# Altium schematic sheet Connector_Sheet.SchDoc
size 420 x 297 mm; SheetNumber: 13; SheetTotal: 14
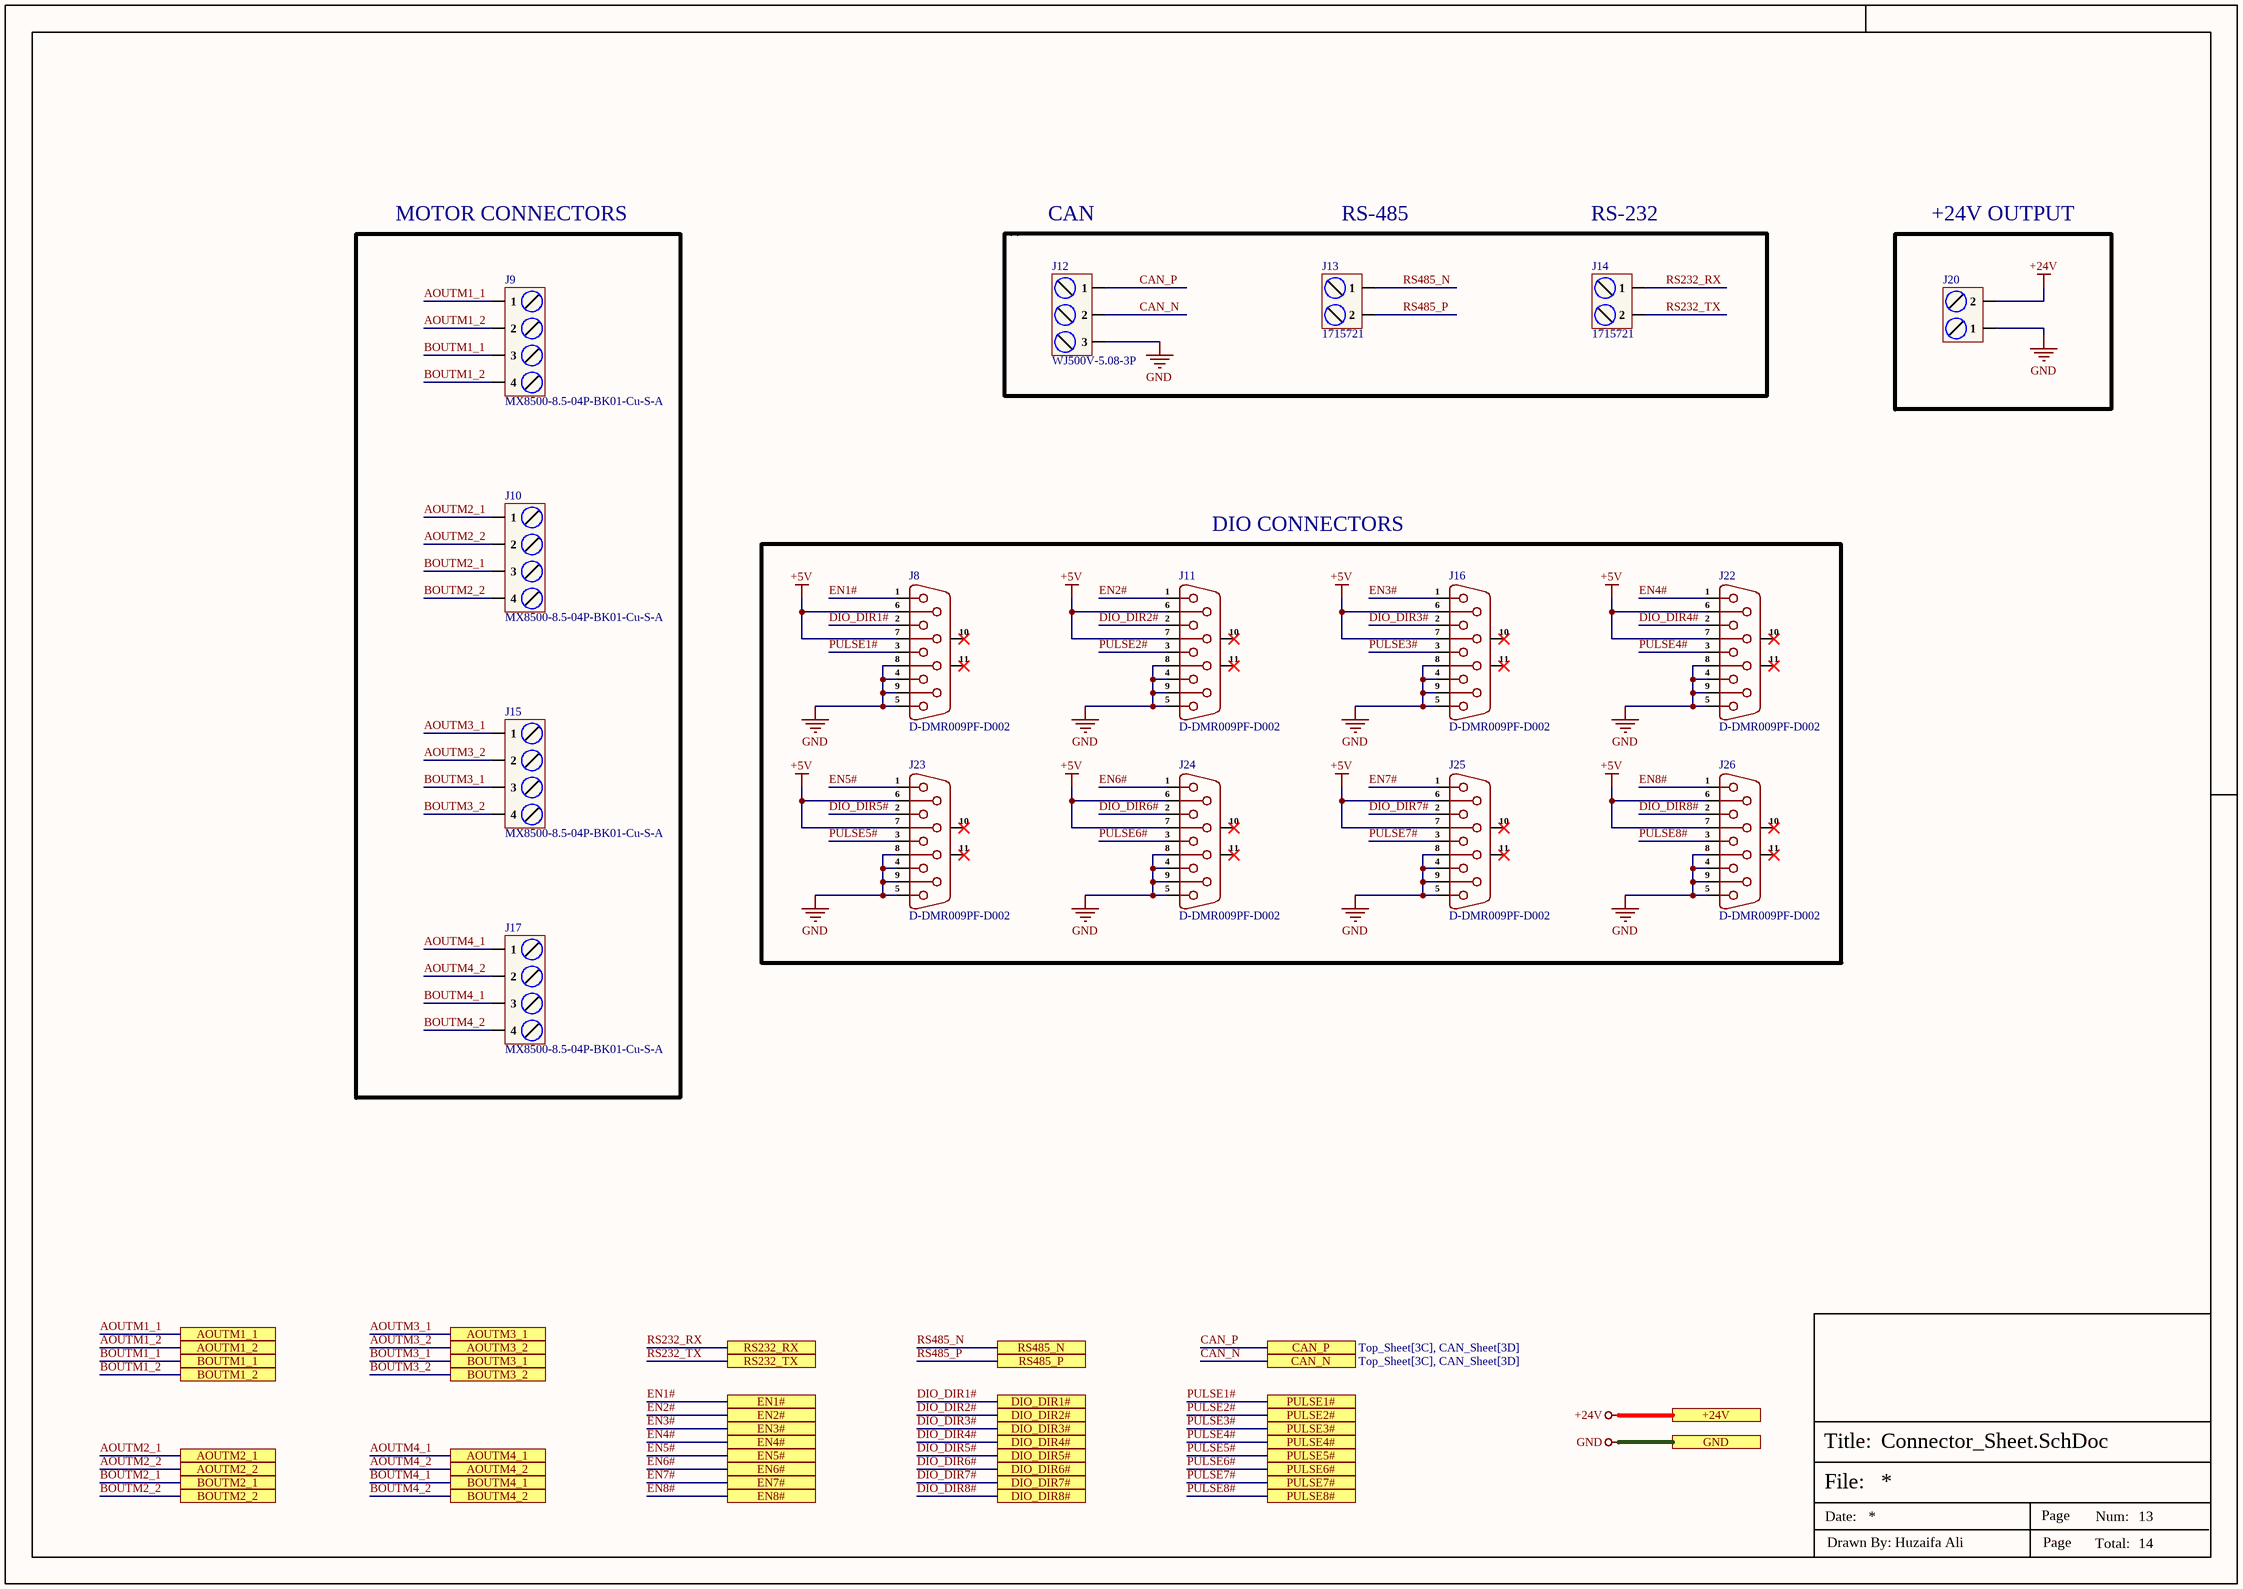
[diagram p0: Connector_Sheet.SchDoc]

## Parts
J8  D-DMR009PF-D002  [D-DMR009PF-D002]
J9  MX8500-8.5-04P-BK01-Cu-S-A  [MX8500-8.5-04P-BK01-Cu-S-A]
J10  MX8500-8.5-04P-BK01-Cu-S-A  [MX8500-8.5-04P-BK01-Cu-S-A]
J11  D-DMR009PF-D002  [D-DMR009PF-D002]
J12  WJ500V-5.08-3P  [WJ500V-5.08-3P]
J13  1715721  [1715721]
J14  1715721  [1715721]
J15  MX8500-8.5-04P-BK01-Cu-S-A  [MX8500-8.5-04P-BK01-Cu-S-A]
J16  D-DMR009PF-D002  [D-DMR009PF-D002]
J17  MX8500-8.5-04P-BK01-Cu-S-A  [MX8500-8.5-04P-BK01-Cu-S-A]
J20  MXHB9500-9.5-02P-BK01-Cu-S-A  [MXHB9500-9.5-02P-BK01-Cu-S-A]  (value not drawn)
J22  D-DMR009PF-D002  [D-DMR009PF-D002]
J23  D-DMR009PF-D002  [D-DMR009PF-D002]
J24  D-DMR009PF-D002  [D-DMR009PF-D002]
J25  D-DMR009PF-D002  [D-DMR009PF-D002]
J26  D-DMR009PF-D002  [D-DMR009PF-D002]

## Ports
+24V (see Top_Sheet[3C], Power_Sheet[5D], Stepper_Driver_Sheet1[5D], Stepper_Driver_Sheet2[5D], Stepper_Driver_Sheet3[5D], Stepper_Driver_Sheet4[5D]), AOUTM1_1 (see Top_Sheet[3D], Stepper_Driver_Sheet1[2D]), AOUTM1_2 (see Top_Sheet[3D], Stepper_Driver_Sheet1[2D]), AOUTM2_1 (see Top_Sheet[3D], Stepper_Driver_Sheet2[2D]), AOUTM2_2 (see Top_Sheet[3D], Stepper_Driver_Sheet2[2D]), AOUTM3_1 (see Top_Sheet[3D], Stepper_Driver_Sheet3[2D]), AOUTM3_2 (see Top_Sheet[3D], Stepper_Driver_Sheet3[2D]), AOUTM4_1 (see Top_Sheet[3D], Stepper_Driver_Sheet4[2D]), AOUTM4_2 (see Top_Sheet[3D], Stepper_Driver_Sheet4[2D]), BOUTM1_1 (see Top_Sheet[3D], Stepper_Driver_Sheet1[2D]), BOUTM1_2 (see Top_Sheet[3D], Stepper_Driver_Sheet1[2D]), BOUTM2_1 (see Top_Sheet[3D], Stepper_Driver_Sheet2[2D]), BOUTM2_2 (see Top_Sheet[3D], Stepper_Driver_Sheet2[2D]), BOUTM3_1 (see Top_Sheet[3D], Stepper_Driver_Sheet3[2D]), BOUTM3_2 (see Top_Sheet[3D], Stepper_Driver_Sheet3[2D]), BOUTM4_1 (see Top_Sheet[3D], Stepper_Driver_Sheet4[2D]), BOUTM4_2 (see Top_Sheet[3D], Stepper_Driver_Sheet4[2D]), CAN_N (see Top_Sheet[3C], CAN_Sheet[3D]), CAN_P (see Top_Sheet[3C], CAN_Sheet[3D]), DIO_DIR1# (see Top_Sheet[4D], DIO_Isolation_Sheet[6C]), DIO_DIR2# (see Top_Sheet[4D], DIO_Isolation_Sheet[6C]), DIO_DIR3# (see Top_Sheet[4D], DIO_Isolation_Sheet[6C]), DIO_DIR4# (see Top_Sheet[4D], DIO_Isolation_Sheet[6C]), DIO_DIR5# (see Top_Sheet[4D], DIO_Isolation_Sheet[6C]), DIO_DIR6# (see Top_Sheet[4D], DIO_Isolation_Sheet[6C]), DIO_DIR7# (see Top_Sheet[4D], DIO_Isolation_Sheet[6C]), DIO_DIR8# (see Top_Sheet[4D], DIO_Isolation_Sheet[6C]), EN1# (see Top_Sheet[4C], DIO_Isolation_Sheet[6B]), EN2# (see Top_Sheet[4C], DIO_Isolation_Sheet[6B]), EN3# (see Top_Sheet[4C], DIO_Isolation_Sheet[6C]), EN4# (see Top_Sheet[4D], DIO_Isolation_Sheet[6C]), EN5# (see Top_Sheet[4D], DIO_Isolation_Sheet[6C]), EN6# (see Top_Sheet[4D], DIO_Isolation_Sheet[6C]), EN7# (see Top_Sheet[4D], DIO_Isolation_Sheet[6C]), EN8# (see Top_Sheet[4D], DIO_Isolation_Sheet[6C]), GND (see Top_Sheet[3C], CAN_Sheet[5D], Controller_Sheet[5D], DIO_Isolation_Sheet[5D], EtherCAT_Sheet[5D], GPIO_EXPANDER_Sheet[5D], Power_Sheet[5D], RJ45_Sheet[5D], RS485_RS232_Sheet[2D], Stepper_Driver_Sheet1[5D], Stepper_Driver_Sheet2[5D], Stepper_Driver_Sheet3[5D], Stepper_Driver_Sheet4[5D]), PULSE1# (see Top_Sheet[3C], DIO_Isolation_Sheet[6C]), PULSE2# (see Top_Sheet[3C], DIO_Isolation_Sheet[6C]), PULSE3# (see Top_Sheet[3C], DIO_Isolation_Sheet[6C]), PULSE4# (see Top_Sheet[3C], DIO_Isolation_Sheet[6C]), PULSE5# (see Top_Sheet[3C], DIO_Isolation_Sheet[6C]), PULSE6# (see Top_Sheet[3C], DIO_Isolation_Sheet[6C]), PULSE7# (see Top_Sheet[3C], DIO_Isolation_Sheet[6C]), PULSE8# (see Top_Sheet[3D], DIO_Isolation_Sheet[6C]), RS232_RX (see Top_Sheet[4C], RS485_RS232_Sheet[5D]), RS232_TX (see Top_Sheet[4C], RS485_RS232_Sheet[5D]), RS485_N (see Top_Sheet[4C], RS485_RS232_Sheet[5D]), RS485_P (see Top_Sheet[4C], RS485_RS232_Sheet[5D])

## Nets
+5V: J8.6 J8.7 J11.6 J11.7 J16.6 J16.7 J22.6 J22.7 J23.6 J23.7 J24.6 J24.7 J25.6 J25.7 J26.6 J26.7
+24V: J20.2 ; port +24V
GND: J8.4 J8.5 J8.8 J8.9 J11.4 J11.5 J11.8 J11.9 J12.3 J16.4 J16.5 J16.8 J16.9 J20.1 J22.4 J22.5 J22.8 J22.9 J23.4 J23.5 J23.8 J23.9 J24.4 J24.5 J24.8 J24.9 J25.4 J25.5 J25.8 J25.9 J26.4 J26.5 J26.8 J26.9 ; port GND
AOUTM1_1: J9.1 ; port AOUTM1_1
AOUTM1_2: J9.2 ; port AOUTM1_2
AOUTM2_1: J10.1 ; port AOUTM2_1
AOUTM2_2: J10.2 ; port AOUTM2_2
AOUTM3_1: J15.1 ; port AOUTM3_1
AOUTM3_2: J15.2 ; port AOUTM3_2
AOUTM4_1: J17.1 ; port AOUTM4_1
AOUTM4_2: J17.2 ; port AOUTM4_2
BOUTM1_1: J9.3 ; port BOUTM1_1
BOUTM1_2: J9.4 ; port BOUTM1_2
BOUTM2_1: J10.3 ; port BOUTM2_1
BOUTM2_2: J10.4 ; port BOUTM2_2
BOUTM3_1: J15.3 ; port BOUTM3_1
BOUTM3_2: J15.4 ; port BOUTM3_2
BOUTM4_1: J17.3 ; port BOUTM4_1
BOUTM4_2: J17.4 ; port BOUTM4_2
CAN_N: J12.2 ; port CAN_N
CAN_P: J12.1 ; port CAN_P
DIO_DIR1#: J8.2 ; port DIO_DIR1#
DIO_DIR2#: J11.2 ; port DIO_DIR2#
DIO_DIR3#: J16.2 ; port DIO_DIR3#
DIO_DIR4#: J22.2 ; port DIO_DIR4#
DIO_DIR5#: J23.2 ; port DIO_DIR5#
DIO_DIR6#: J24.2 ; port DIO_DIR6#
DIO_DIR7#: J25.2 ; port DIO_DIR7#
DIO_DIR8#: J26.2 ; port DIO_DIR8#
EN1#: J8.1 ; port EN1#
EN2#: J11.1 ; port EN2#
EN3#: J16.1 ; port EN3#
EN4#: J22.1 ; port EN4#
EN5#: J23.1 ; port EN5#
EN6#: J24.1 ; port EN6#
EN7#: J25.1 ; port EN7#
EN8#: J26.1 ; port EN8#
PULSE1#: J8.3 ; port PULSE1#
PULSE2#: J11.3 ; port PULSE2#
PULSE3#: J16.3 ; port PULSE3#
PULSE4#: J22.3 ; port PULSE4#
PULSE5#: J23.3 ; port PULSE5#
PULSE6#: J24.3 ; port PULSE6#
PULSE7#: J25.3 ; port PULSE7#
PULSE8#: J26.3 ; port PULSE8#
RS232_RX: J14.1 ; port RS232_RX
RS232_TX: J14.2 ; port RS232_TX
RS485_N: J13.1 ; port RS485_N
RS485_P: J13.2 ; port RS485_P

Not connected (* = marked no-connect by the designer): J8 10(MH1)* 11(MH2)*; J11 10(MH1)* 11(MH2)*; J16 10(MH1)* 11(MH2)*; J22 10(MH1)* 11(MH2)*; J23 10(MH1)* 11(MH2)*; J24 10(MH1)* 11(MH2)*; J25 10(MH1)* 11(MH2)*; J26 10(MH1)* 11(MH2)*

## Notes on the sheet
- MOTOR CONNECTORS
- CAN
- RS-485
- RS-232
- +24V OUTPUT
- DIO CONNECTORS
- File:
- Title:
- Date:
- Page
- Num:
- Total:
- Drawn By: Huzaifa Ali

## Library data of the parts
J8 J11 J16 J22-J26 = D-DMR009PF-D002: 9P Female D-Sub Right-Angle 2 3A -50℃~+105℃ Push-Pull D-Sub / VGA connector ROHS; Manufacturer: Ckmtw; Manufacturer Part Number: D-DMR009PF-D002; Package: Push-Pull; LCSC Part Number: C141882; Item Type: VGA connector; ComponentLink1Description: LCSC; ComponentLink1URL: https://www.lcsc.com/product-detail/D-Sub-VGA-connector_Ckmtw-Shenzhen-Cankemeng-D-DMR009PF-D002_C141882.html
J9 J10 J15 J17 = MX8500-8.5-04P-BK01-Cu-S-A: Tin 4 1 8.5mm -40℃~+105℃ 20A 300V Black 12~22 Straight pin Copper Alloy 2.5 Plugin,P=8.5mm Barrier Terminal Blocks ROHS; Manufacturer: MAX; Manufacturer Part Number: MX8500-8.5-04P-BK01-Cu-S-A; Package: Plugin,P=8.5mm; LCSC Part Number: C5188508; Item Type: Terminal Block; ComponentLink1Description: LCSC; ComponentLink1URL: https://www.lcsc.com/product-detail/Barrier-Terminal-Blocks_MAX-MX8500-8-5-04P-BK01-Cu-S-A_C5188508.html
J12 = WJ500V-5.08-3P: 1x3P 18A -40℃~+105℃ 250V Green 14~30 Straight pin 5.08mm 2.5 1 3 Plugin,P=5.08mm Screw terminal ROHS; Manufacturer: Ningbo Kangnex Elec; Item Type: Terminal Block; Manufacturer Part Number: WJ500V-5.08-3P; Package: Plugin,P=5.08mm; LCSC Part Number: C72334; ComponentLink1Description: LCSC; ComponentLink1URL: https://www.lcsc.com/product-detail/Screw-terminal_Ningbo-Kangnex-Elec-WJ500V-5-08-3P_C72334.html
J13 J14 = 1715721: TERM BLK 2P SIDE ENT 5.08MM PCB; Manufacturer: Phoenix Contact; Item Type: Terminal Blocks; Supplier: Digikey; Supplier Part Number: 277-1263-ND; Manufacturer Part Number: 1715721; RoHS: Yes; Stock: 13160; Pricing: 1=0.94 (USD); ComponentLink1URL: https://datasheet.ciiva.com/1120/1697161-1120393.pdf?src-supplier=Farnell; ComponentLink1Description: https://datasheet.ciiva.com/1120/1697161-1120393.pdf?src-supplier=Farnell; ComponentLink2URL: https://datasheet.ciiva.com/832/1715721-832095.pdf?src-supplier=Digikey; ComponentLink2Description: https://datasheet.ciiva.com/832/1715721-832095.pdf?src-supplier=Digikey; ComponentLink3URL: https://datasheet.ciiva.com/15169/getdatasheetpartid-212174-15169929.pdf?src-supplier=Verical; ComponentLink3Description: https://datasheet.ciiva.com/15169/getdatasheetpartid-212174-15169929.pdf?src-supplier=Verical; ComponentLink4URL: https://datasheet.ciiva.com/16046/1715721-16046034.pdf?src-supplier=Onlinecomponents.com; ComponentLink4Description: https://datasheet.ciiva.com/16046/1715721-16046034.pdf?src-supplier=Onlinecomponents.com
J20 = MXHB9500-9.5-02P-BK01-Cu-S-A: Tin 1x2P Corner pin Three sides 2 1 9.5mm -40℃~+105℃ 20A 300V Black 10~22 Copper Alloy 0.5~4 Plugin,P=9.5mm Barrier Terminal Blocks ROHS; Manufacturer: MAX; Manufacturer Part Number: MXHB9500-9.5-02P-BK01-Cu-S-A; Package: Plugin,P=9.5mm; LCSC Part Number: C7542168; Item Type: Terminal Block; ComponentLink1Description: LCSC; ComponentLink1URL: https://www.lcsc.com/product-detail/Barrier-Terminal-Blocks_MAX-MXHB9500-9-5-02P-BK01-Cu-S-A_C7542168.html